# Altium schematic sheet precharge_circuit.SchDoc
size A4
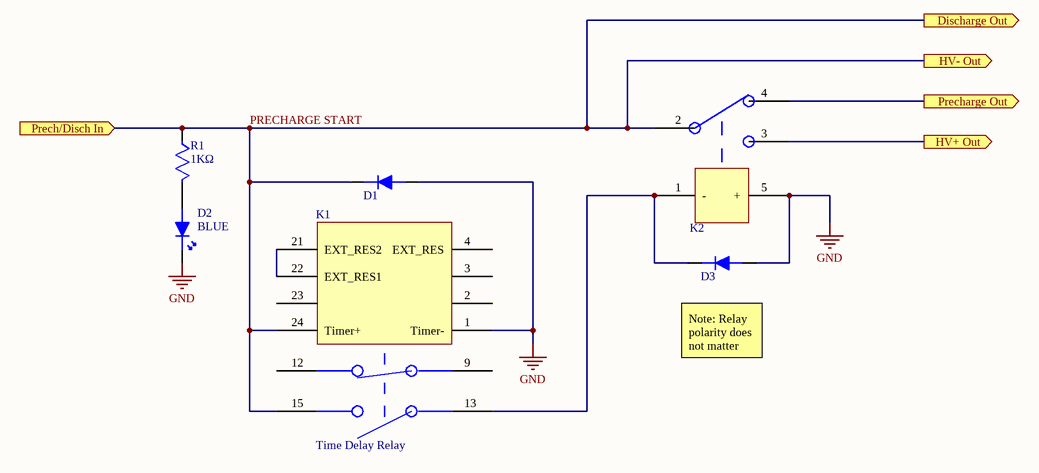
[diagram p0: precharge_circuit.SchDoc]

## Parts
D1  SD560BTR  [DIODE]  (value not drawn)
D2  BLUE  [LED 0603]
D3  SD560BTR  [DIODE]  (value not drawn)
K1  Time Delay Relay  [RELAY TIMED]
K2  G5Q-14-DC12  [RELAY SPDT PRECHARGE]  (value not drawn)
R1  1KΩ  [RESISTOR CRCW0603]

## Ports
Discharge Out (out), HV+ Out (out), HV- Out (out), Prech/Disch In (in), Precharge Out (out)

## Nets
GND: D1.1 D2.2 D3.1 K1.1(Timer-) K2.5(+)
HV+ Out: K2.3 ; port HV+ Out
Precharge Out: K2.4 ; port Precharge Out
PRECHARGE START: D1.2 K1.15(NO-1) K1.24(Timer+) K2.2 R1.1 ; port Prech/Disch In, port HV- Out, port Discharge Out
NetD2_1: D2.1 R1.2
NetD3_2: D3.2 K1.13(NO-2) K2.1(-)
NetK1_21: K1.21(EXT_RES2) K1.22(EXT_RES1)

Not connected (* = marked no-connect by the designer): K1 2 3 4(EXT_RES) 9(NC-1) 12(NC-2) 23

## Notes on the sheet
- (near D3) Note: Relay polarity does not matter

## Library data of the parts
D1 D3 = SD560BTR: DIODE GEN PURP 600V 5A SMB; Manufacturer: SMC; Supplier 1: Digi-Key; Manufacturer Part Number: SD560BTR; Stock 1: 90144; Pricing 1: 1=0.42, 10=0.309, 100=0.1468, 500=0.11978, 1000=0.08887 (USD); Mount: Surface Mount; Packaging: Tape and Reel; Max Reverse Voltage (DC): 600V; ComponentLink1URL: http://www.smc-diodes.com/propdf/SD560B%20N1412%20REV.D.pdf?src-supplier=Digi-Key; ComponentLink1Description: http://www.smc-diodes.com/propdf/SD560B%20N1412%20REV.D.pdf?src-supplier=Digi-Key; Supplier Part Number 1: 1655-1530-6-ND; Category: Discrete Semiconductor Products; Average Rectified Current: 5A; Case/Package: SMB
D2 = LTST-C191TBKT-5A: LED BLUE CLEAR CHIP SMD; Manufacturer: Vishay Lite-On; Lens Color: Colorless; Lens Style: Diffused,Colorless,Rectangular; Viewing Angle: 130°; Forward Current: 20mA; Forward Voltage: 2.8V; Luminous Intensity: 15mcd; Test Current: 5mA; Dominant Wavelength: 473nm; Number of LEDs: 1; Voltage: 29V; Supplier 1: Digi-Key; Manufacturer Part Number: LTST-C191TBKT-5A; Stock 1: 9654; Pricing 1: 1=0.5, 10=0.359, 100=0.1596, 500=0.11172, 1000=0.09177, 2500=0.0798 (USD); Mount: Surface Mount; Case/Package: 0603; Number of Pins: 2; Color: Blue; Case Code (Metric): 1608; Case Code (Imperial): 0603; Min Operating Temperature: -20°C; Max Operating Temperature: 80°C; Packaging: Tape and Reel; Package Quantity: 5000; Illumination Color: Blue; Lens Transparency: Clear; Length: 1.6mm; Height: 0.55mm; Width: 0.8mm; Radiation Hardening: No; ComponentLink1URL: http://optoelectronics.liteon.com/upload/download/DS22-2003-020/LTST-C191TBKT-5A.pdf?src-supplier=Digi-Key; ComponentLink1Description: http://optoelectronics.liteon.com/upload/download/DS22-2003-020/LTST-C191TBKT-5A.pdf?src-supplier=Digi-Key; ComponentLink2URL: http://components.arrow.com/part/dataview/52218576S9813001N1331?src-supplier=Arrow; ComponentLink2Description: http://components.arrow.com/part/dataview/52218576S9813001N1331?src-supplier=Arrow; ComponentLink3URL: http://optoelectronics.liteon.com/zh-cn/api/DwonloadFileHandler.ashx?txtSpecNo=DS22-2003-020&txtPartNo=LTST-C191TBKT-5A&src-supplier=Avnet; ComponentLink3Description: http://optoelectronics.liteon.com/zh-cn/api/DwonloadFileHandler.ashx?txtSpecNo=DS22-2003-020&txtPartNo=LTST-C191TBKT-5A&src-supplier=Avnet; ComponentLink4URL: http://www.mouser.com/ds/2/239/LTST-C191TBKT-5A-1150649.pdf?src-supplier=Mouser; ComponentLink4Description: http://www.mouser.com/ds/2/239/LTST-C191TBKT-5A-1150649.pdf?src-supplier=Mouser; Supplier Part Number 1: 160-2212-6-ND; Category: Optoelectronics
K1 = H3FA-A-DC12: Time Delay & Timing Relays 12VDC 1s-10m Contact SPST-NO+SPST-NC; Manufacturer: Omron; Throw Configuration: SPST,DPST; Relay Type: Integrated; Supplier 1: Digi-Key; Manufacturer Part Number: H3FA-A-DC12; Stock 1: 0; Pricing 1: 1=79, 10=74.844, 25=70.686, 50=66.528, 100=62.37 (USD); Mount: Through Hole; Package Quantity: 1; Termination: PC Pin; ComponentLink1URL: http://www.mouser.com/ds/2/307/-794852.pdf?src-supplier=Mouser; ComponentLink1Description: http://www.mouser.com/ds/2/307/-794852.pdf?src-supplier=Mouser; ComponentLink2URL: http://www.ia.omron.com/data_pdf/cat/h3fa_ds_e_7_2_csm89.pdf?src-supplier=Digi-Key; ComponentLink2Description: http://www.ia.omron.com/data_pdf/cat/h3fa_ds_e_7_2_csm89.pdf?src-supplier=Digi-Key; Category: Industrial Automation and Controls; Supplier Part Number 1: Z6344-ND
K2 = G5Q-14-DC12: Electromechanical Relay SPDT 5(NO)/3(NC)ADC/10(NO)/3(NC)AAC 12VDC 360Ohm Through Hole; Manufacturer: Omron; Coil Resistance: 360R; Coil Current: 33.3mA; Operate Time: 10ms; Contact Current Rating: 10A; Coil Voltage (DC): 12V; Relay Type: General Purpose; Coil Type: Non-Latching; Release Time: 5ms; Coil Power: 400mW; Max Voltage Rating (AC): 277V; Max Voltage Rating (DC): 30V; Supplier 1: Digi-Key; Manufacturer Part Number: G5Q-14-DC12; Stock 1: 53890; Pricing 1: 1=1.43, 10=1.344, 25=1.1948, 50=1.1348, 100=1.0751, 250=0.95568, 500=0.89596, 1000=0.83622, 5000=0.80636 (USD); Mount: Through Hole; Number of Pins: 5; Weight: 6.5g; Contact Material: Silver; Min Operating Temperature: -40°C; Max Operating Temperature: 85°C; Packaging: Bulk; Throw Configuration: SPDT; Termination: PC Pin; Package Quantity: 400; Voltage Rating (AC): 277V; Power Consumption: 400mW; Current Rating: 10A; Length: 20.3mm; Height: 15.8mm; Width: 10.3mm; Depth: 10.3mm; Radiation Hardening: No; Lead Free: Lead Free; ComponentLink1URL: http://www.mouser.com/ds/2/307/en-g5q-22333.pdf?src-supplier=Mouser; ComponentLink1Description: http://www.mouser.com/ds/2/307/en-g5q-22333.pdf?src-supplier=Mouser; Supplier Part Number 1: Z225-ND; Category: Relays
R1 = CRCW06031K00FKEA: RES SMD 1K OHM 1% 1/10W 0603; Manufacturer: Vishay Dale; Resistance: 1kR; Temperature Coefficient: 100ppm/°C; Power Rating: 100mW; Voltage Rating: 75V; Supplier 1: Digi-Key; Manufacturer Part Number: CRCW06031K00FKEA; Stock 1: 1811474; Pricing 1: 1=0.1, 10=0.034, 100=0.0139, 1000=0.00623, 2500=0.0054 (USD); Mount: Surface Mount; Case/Package: 0603; Number of Pins: 2; Weight: 7.1E-05oz; Contact Plating: Tin; Case Code (Metric): 1608; Case Code (Imperial): 0603; Min Operating Temperature: -55°C; Max Operating Temperature: 155°C; Composition: Thick Film; Tolerance: 1%; Termination: SMD/SMT; Packaging: Tape and Reel; Package Quantity: 10; Number of Terminations: 2; Military Standard: Not; Max Power Dissipation: 100mW; Voltage Rating (DC): 75V; Features: Automotive AEC-Q200; Length: 1.55mm; Height: 0.45mm; Width: 0.033inch; Depth: 0.85mm; Radiation Hardening: No; Lead Free: Lead Free; REACH SVHC: Unknown; ComponentLink1URL: http://www.vishay.com/docs/20035/dcrcwe3.pdf?src-supplier=Digi-Key; ComponentLink1Description: http://www.vishay.com/docs/20035/dcrcwe3.pdf?src-supplier=Digi-Key; ComponentLink2URL: http://uk.rs-online.com/webdocs/0d98/0900766b80d98afc.pdf?src-supplier=RSComponents; ComponentLink2Description: http://uk.rs-online.com/webdocs/0d98/0900766b80d98afc.pdf?src-supplier=RSComponents; ComponentLink3URL: http://www.vishay.com/docs/20035/dcrcwe3.pdf?src-supplier=Avnet; ComponentLink3Description: http://www.vishay.com/docs/20035/dcrcwe3.pdf?src-supplier=Avnet; ComponentLink4URL: http://www.vishay.com/docs/20035/dcrcwe3.pdf?src-supplier=Avnet+Asia; ComponentLink4Description: http://www.vishay.com/docs/20035/dcrcwe3.pdf?src-supplier=Avnet+Asia; ComponentLink5URL: http://www.farnell.com/datasheets/2310790.pdf?src-supplier=Element14; ComponentLink5Description: http://www.farnell.com/datasheets/2310790.pdf?src-supplier=Element14; ComponentLink6URL: https://www.distrelec.biz/Web/Downloads/a_/en/flD-CRCW-e3_data_en.pdf?mime=application%2Fpdf&src-supplier=Distrelec; ComponentLink6Description: https://www.distrelec.biz/Web/Downloads/a_/en/flD-CRCW-e3_data_en.pdf?mime=application%2Fpdf&src-supplier=Distrelec; ComponentLink7URL: http://www.vishay.com/docs/20035/dcrcwe3.pdf?src-supplier=Future+Electronics; ComponentLink7Description: http://www.vishay.com/docs/20035/dcrcwe3.pdf?src-supplier=Future+Electronics; ComponentLink8URL: http://www.vishay.com/docs/20035/dcrcwe3.pdf?src-supplier=Avnet+Europe; ComponentLink8Description: http://www.vishay.com/docs/20035/dcrcwe3.pdf?src-supplier=Avnet+Europe; Supplier Part Number 1: 541-1.00KHCT-ND; Category: Resistors